# Altium schematic sheet SFP.SchDoc
size A4
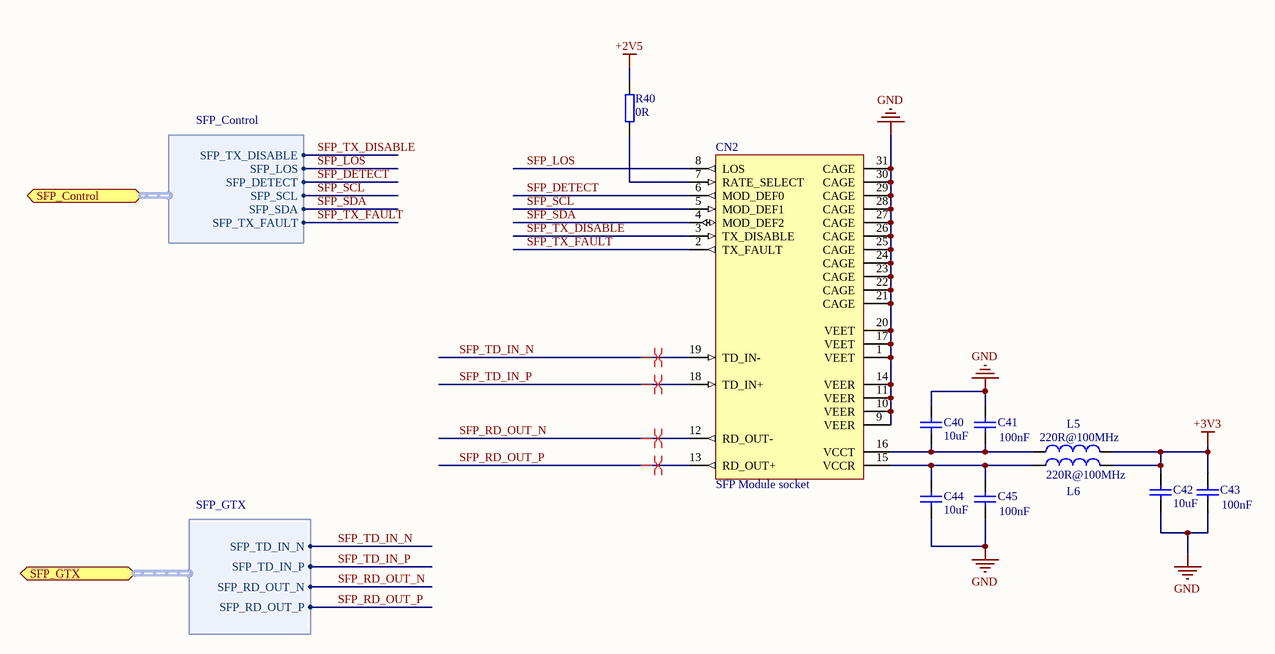
[diagram p0: SFP.SchDoc]

## Parts
C40  10uF  [CC1608-0603]
C41  100nF  [CC1005-0402]
C42  10uF  [CC1608-0603]
C43  100nF  [CC1005-0402]
C44  10uF  [CC1608-0603]
C45  100nF  [CC1005-0402]
CN2  SFP Module socket  [SFP_SINGLE_PORT]
L5  Impedance: 220R@100MHz  [0603]  (hidden comment: 220R@100MHz Ferrite Bead)
L6  Impedance: 220R@100MHz  [0603]  (hidden comment: 220R@100MHz Ferrite Bead)
R40  0R  [0603]

## Ports
SFP_Control (harness SFP_Control), SFP_GTX (harness SFP_GTX)

## Harnesses
SFP_GTX: SFP_TD_IN_N, SFP_TD_IN_P, SFP_RD_OUT_N, SFP_RD_OUT_P
SFP_Control: SFP_DETECT, SFP_LOS, SFP_SCL, SFP_SDA, SFP_TX_FAULT, SFP_TX_DISABLE

## Nets
+2V5: R40.1
+3V3: C42.1 C43.2 L5.2 L6.2
GND: C40.1 C41.2 C42.2 C43.1 C44.2 C45.1 CN2.1(VEET) CN2.9(VEER) CN2.10(VEER) CN2.11(VEER) CN2.14(VEER) CN2.17(VEET) CN2.20(VEET) CN2.21(CAGE) CN2.22(CAGE) CN2.23(CAGE) CN2.24(CAGE) CN2.25(CAGE) CN2.26(CAGE) CN2.27(CAGE) CN2.28(CAGE) CN2.29(CAGE) CN2.30(CAGE) CN2.31(CAGE)
SFP_DETECT: CN2.6(MOD_DEF0) ; port SFP_Control.SFP_DETECT
SFP_LOS: CN2.8(LOS) ; port SFP_Control.SFP_LOS
SFP_RD_OUT_N: CN2.12(RD_OUT-) ; port SFP_GTX.SFP_RD_OUT_N
SFP_RD_OUT_P: CN2.13(RD_OUT+) ; port SFP_GTX.SFP_RD_OUT_P
SFP_SCL: CN2.5(MOD_DEF1) ; port SFP_Control.SFP_SCL
SFP_SDA: CN2.4(MOD_DEF2) ; port SFP_Control.SFP_SDA
SFP_TD_IN_N: CN2.19(TD_IN-) ; port SFP_GTX.SFP_TD_IN_N
SFP_TD_IN_P: CN2.18(TD_IN+) ; port SFP_GTX.SFP_TD_IN_P
SFP_TX_DISABLE: CN2.3(TX_DISABLE) ; port SFP_Control.SFP_TX_DISABLE
SFP_TX_FAULT: CN2.2(TX_FAULT) ; port SFP_Control.SFP_TX_FAULT
NetC40_2: C40.2 C41.1 CN2.16(VCCT) L5.1
NetC44_1: C44.1 C45.2 CN2.15(VCCR) L6.1
NetCN2_7: CN2.7(RATE_SELECT) R40.2

## Layout directives
differential pair: SFP_RD_OUT_N, SFP_RD_OUT_P, SFP_TD_IN_N, SFP_TD_IN_P

## Library data of the parts
C40 C42 C44 = CC0603_10UF_6.3V_20%_X5R: Capacitor; Manufacturer1: TDK; Manufacturer1 PN: C1608X5R0J106M; TC: X5R; Tolerance: ±20%; Voltage: 6.3V; Published: 8-Jun-2000; LatestRevisionDate: 17-Jul-2002; LatestRevisionNote: Re-released for DXP Platform.; PackageReference: RAD-0.3; Publisher: Altium Limited; Distributor1: Digikey; Distributor1 PN: 445-4112-1-ND; Case: 0603; Value: 10uF
C41 C43 C45 = CC0402_100NF_16V_10%_X7R: Capacitor; Manufacturer1: TDK; Manufacturer1 PN: C1005X7R1C104K; TC: X7R; Tolerance: ±10%; Voltage: 16V; Published: 8-Jun-2000; LatestRevisionDate: 17-Jul-2002; LatestRevisionNote: Re-released for DXP Platform.; PackageReference: RAD-0.3; Publisher: Altium Limited; Distributor1: Digikey; Distributor1 PN: 445-4952-1-ND; Case: 0402; Value: 100nF
CN2 = SFP_SOCKET_SINGLE: Socket for SFP module; RefId: Far/1256176
L5 L6 = L_FERRITE_BEAD: ferrite bead; Manufacturer1: Murata; Manufacturer1 PN: BLM18KG221SN1D; Current Rating: 2.2A; DCR: 50mOhm; Case: 0603; Distributor1: Digikey; Distributor1 PN: 490-5255-1-ND
R40 = R0603_0R_0.1W_JUMPER: SMD Resistor; Manufacturer1: Yageo; Manufacturer1 PN: RC0603JR-070RL; TCR: 200ppm; Power Rating: 0.1W; Case: 0603; Distributor1: DigiKey; Distributor1 PN: 311-0.0GRCT-ND; Tolerance: -; Value: 0R